# EAGLE design OutputSlice (EAGLE 7.5.0)
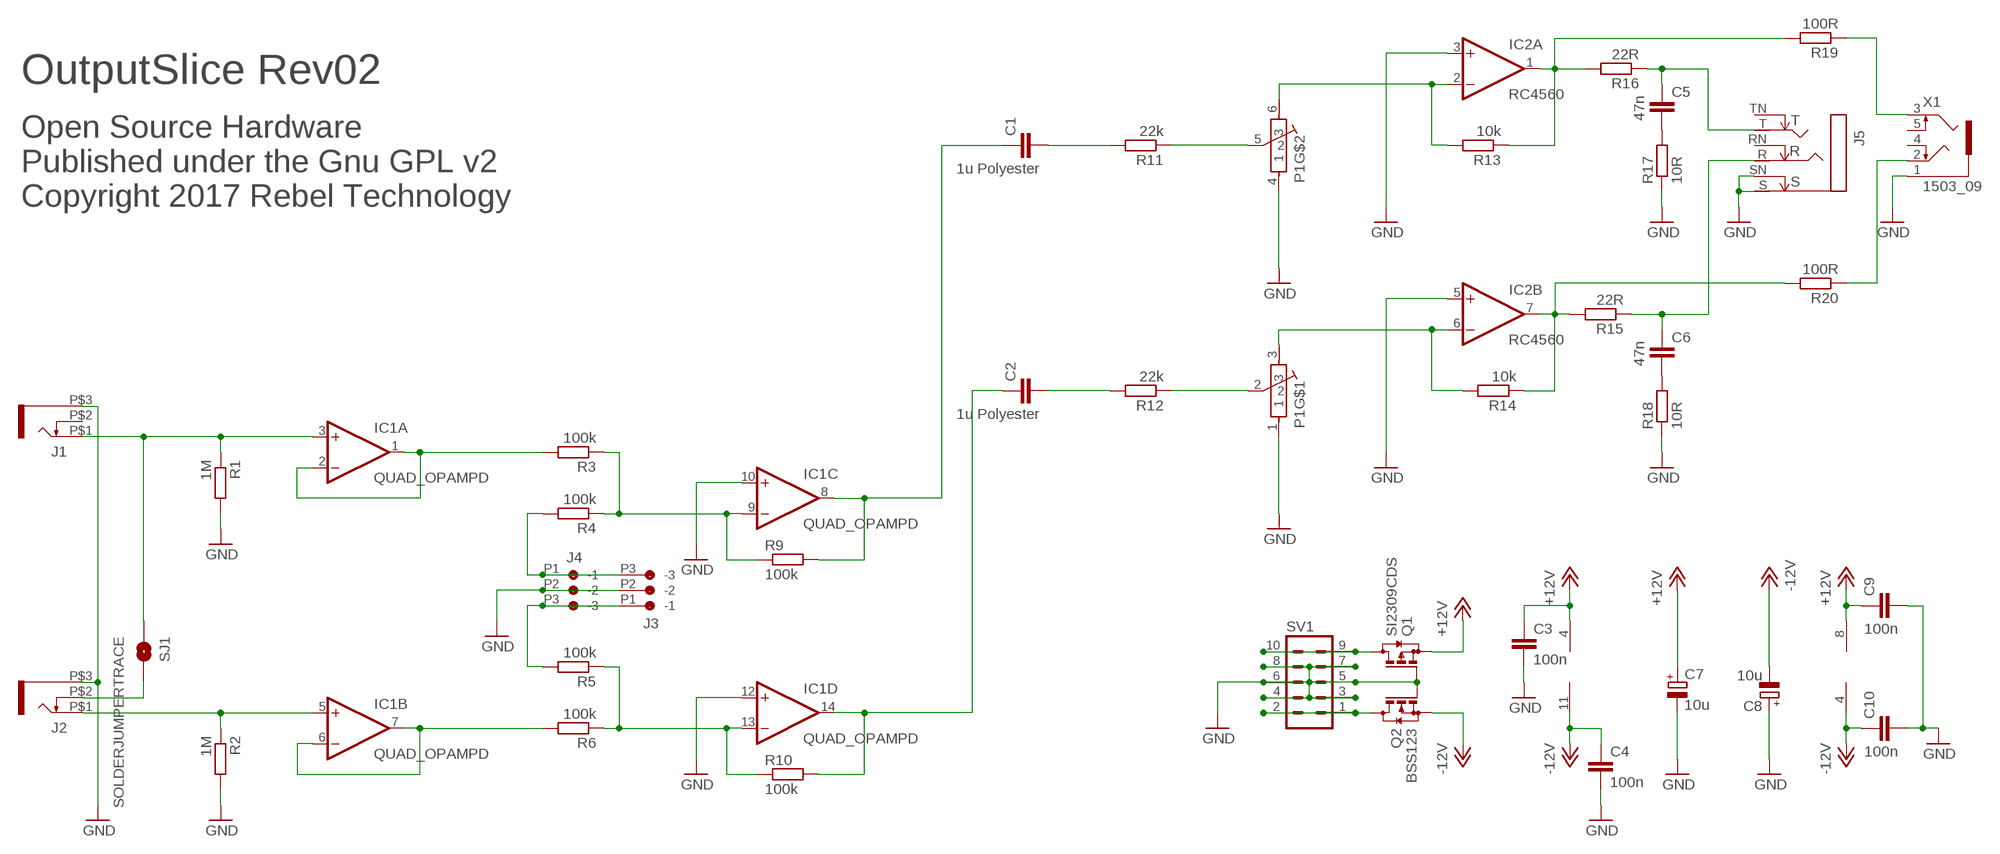
[diagram p0: schematic, sheet 1]

## Parts
C1  1u Polyester  C-EUC1210  [C1210]
C2  1u Polyester  C-EUC1210  [C1210]
C3  100n  C-EUC0603  [C0603]
C4  100n  C-EUC0603  [C0603]
C5  47n  C-EUC0603  [C0603]
C6  47n  C-EUC0603  [C0603]
C7  10u  CPOL-EU153CLV-0505  [153CLV-0505]
C8  10u  CPOL-EU153CLV-0505  [153CLV-0505]
C9  100n  C-EUC0603  [C0603]
C10  100n  C-EUC0603  [C0603]
IC1  QUAD_OPAMPD  [SO14]
IC2  RC4560  NE5532D  [SO08]
J1  JACK-UJ-3502-RSLOT  [UJ-3502-R-SLOT]
J2  JACK-UJ-3502-RSLOT  [UJ-3502-R-SLOT]
J3  CON-JST_PH_3W  [CON-JST_PH_3W]
J4  CON-JST_PH_3W  [CON-JST_PH_3W]
J5  NEUTRIK_NRJ6HFSTD  [NRJ6HF]
P1  POT-BOURNS-PTD902  [POT-BOURNS-PTD902]
Q1  SI2309CDS  BSS84  [SOT23]
Q2  BSS123  [SOT23]
R1  1M  R-EU_0603  [0603]
R2  1M  R-EU_0603  [0603]
R3  100k  R-EU_0603  [0603]
R4  100k  R-EU_0603  [0603]
R5  100k  R-EU_0603  [0603]
R6  100k  R-EU_0603  [0603]
R9  100k  R-EU_0603  [0603]
R10  100k  R-EU_0603  [0603]
R11  22k  R-EU_0603  [0603]
R12  22k  R-EU_0603  [0603]
R13  10k  R-EU_0603  [0603]
R14  10k  R-EU_0603  [0603]
R15  22R  R-EU_0603  [0603]
R16  22R  R-EU_0603  [0603]
R17  10R  R-EU_0603  [0603]
R18  10R  R-EU_0603  [0603]
R19  100R  R-EU_0603  [0603]
R20  100R  R-EU_0603  [0603]
SJ1  SOLDERJUMPERTRACE  [SJ_2S-TRACE]
SV1  MA05-2  [MA05-2]
X1  1503_09  [1503_09]

## Nets
+12V: C3.1 C7.+ C9.1 IC1.4(P:V+) IC2.8(P:V+) Q1.2(S)
-12V: C4.1 C8.- C10.1 IC1.11(P:V-) IC2.4(P:V-) Q2.2(S)
BUS_IN_L: J3.P3(-3) J4.P1(-1) R4.2
BUS_IN_R: J3.P1(-1) J4.P3(-3) R5.2
GND: C3.2 C4.2 C7.- C8.+ C9.2 C10.2 IC1.10(C:+IN) IC1.12(D:+IN) IC2.3(A:+IN) IC2.5(B:+IN) J1.P$3(SLEEVE) J2.P$3(SLEEVE) J3.P2(-2) J4.P2(-2) J5.S J5.SN P1.1 P1.4 Q1.1(G) Q2.1(G) R1.2 R2.2 R17.1 R18.1 SV1.3 SV1.4 SV1.5 SV1.6 SV1.7 SV1.8 X1.1
HP_L: C5.1 J5.T R16.1
HP_R: C6.1 J5.R R15.1
IN_B1: J2.P$2(SW) SJ1.2
IN_L: IC1.3(A:+IN) J1.P$1(TIP) R1.1 SJ1.1
IN_R: IC1.5(B:+IN) J2.P$1(TIP) R2.1
LINE_L: R19.1 X1.3
LINE_R: R20.1 X1.2
N$1: Q2.3(D) SV1.1 SV1.2
N$2: IC2.7(B:OUT) R14.1 R15.2 R20.2
N$3: IC2.2(A:-IN) P1.6 R13.2
N$4: C2.2 R12.2
N$5: P1.5 R11.1
N$6: P1.2 R12.1
N$7: C2.1 IC1.14(D:OUT) R10.2
N$8: C1.2 R11.2
N$10: C1.1 IC1.8(C:OUT) R9.2
N$11: IC1.6(B:-IN) IC1.7(B:OUT) R6.2
N$12: C6.2 R18.2
N$13: IC1.1(A:OUT) IC1.2(A:-IN) R3.2
N$14: Q1.3(D) SV1.9 SV1.10
N$16: IC2.6(B:-IN) P1.3 R14.2
N$19: IC2.1(A:OUT) R13.1 R16.2 R19.2
N$21: C5.2 R17.2
N$45: IC1.13(D:-IN) R5.1 R6.1 R10.1
N$50: IC1.9(C:-IN) R3.1 R4.1 R9.1
Unconnected: J1.P$2(SW) J5.RN J5.TN X1.4 X1.5

## Notes on the sheet
- OutputSlice Rev02
- Open Source Hardware
  Published under the Gnu GPL v2
  Copyright 2017 Rebel Technology

## Library data of the parts
C1-C6 C9 C10 = Rebel:C-EU: CAPACITOR, European symbol
C7 C8 = rcl:CPOL-EU: POLARIZED CAPACITOR, European symbol
IC1 = adafruit:QUAD_OPAMP: OP AMP Standard quad package
IC2 = linear:NE5532: AUDIO AMPLIFIER
J1 J2 = Rebel:JACK-UJ-3502-R
J3 J4 = Rebel:CON-JST_PH_3W
J5 = neutrik_jacks:NEUTRIK_NRJ6HF
P1 = Rebel:POT-BOURNS-PTD902
Q1 = transistor-small-signal:BSS84: P-CHANNEL MOS FET
Q2 = transistor-small-signal:BSS123: N-CHANNEL MOS FET
R1-R6 R9-R20 = Rebel:R-EU_: RESISTOR, European symbol
SJ1 = SparkFun:SOLDERJUMPER: Solder Jumper Standard SMD solder jumper. Used to automate production. Two varients : Normally Open and Normally Closed are the same, but have different paste layers. NC will have a large amount of paste and should jumper during reflow.
SV1 = con-lstb:MA05-2: PIN HEADER; OC_FARNELL: unknown; OC_NEWARK: unknown
X1 = con-lumberg:1503_09: Jack connectors according to JISC 6560, 3.5 mm Klinkeneinbaukupplung nach JISC 6560, 3,5 mm, 3-polig/ stereo, abgewinkelte Ausführung, mit 2 Öffnern und Lötaugen, für Leiterplatten Rückseitenmontage Source: http://www.lumberg.com/Produkte/PDFs/1503_09.pdf; OC_FARNELL: 1243244; OC_NEWARK: unknown

## Board
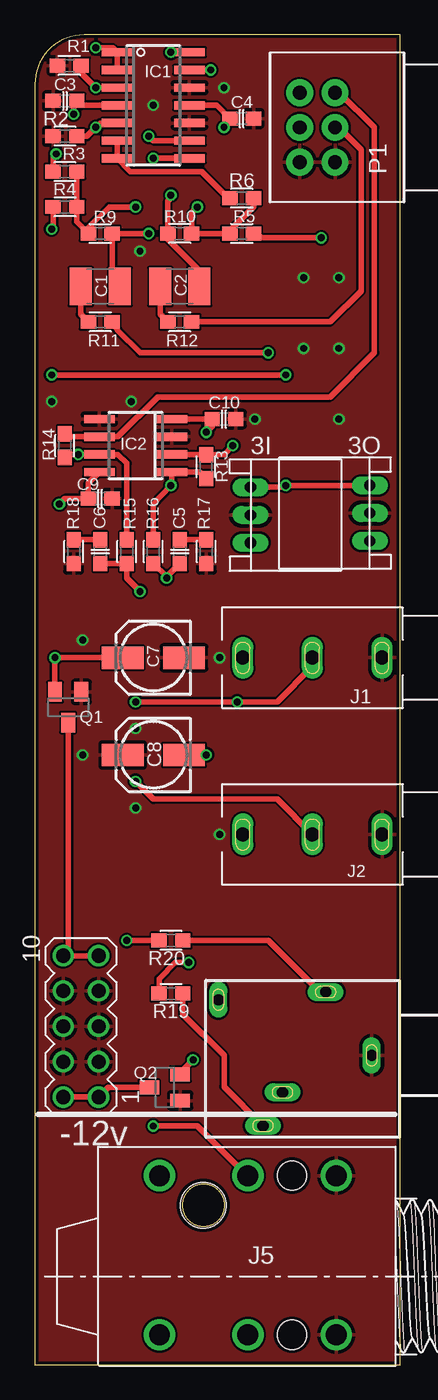
[diagram p1: board, top side]
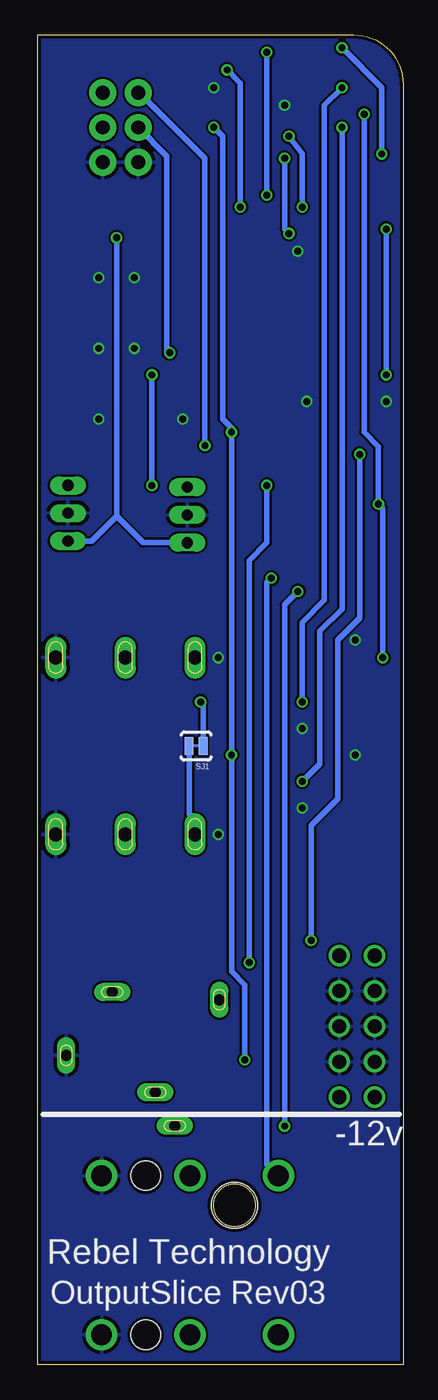
[diagram p2: board, bottom side, seen from below]

Size 26.24 x 95.56 mm. Coordinates in mm from the lower left corner, seen from the top.
Outline: 26.24,0 26.24,95.56 3.56,95.56 arc90 0,92 0,0 26.24,0
Copper layers (1*16): Top 0.035mm / dielectric 1.5mm / Bottom 0.035mm
Design rules "SeeedStudio_2layer_DRU_no_angle_20140221": minimum track width 6mil, minimum drill 12mil, track to track 6mil, track to pad 6mil, pad to pad 6mil, via to via 6mil, smd to smd 0mil, copper to edge 10mil, drill to drill 10mil, minimum pad ring 10mil, minimum via ring 6mil, stop-mask expansion 2mil, vias tented up to drill 100mil, thermal gap 10mil

### Footprints (pad centres in the part's own frame; a part is rotated, then mirrored left to right if it is on the bottom)
C1210 = smd 1.6 x 2.7: 1 -1.4,0; 2 1.4,0
C0603 = smd 1.1 x 1: 1 -0.85,0; 2 0.85,0
153CLV-0505 = smd 3 x 1.6: + 2.2,0; - -2.2,0
SO14 = smd 0.6 x 2.2: 1 -3.81,-2.6; 2 -2.54,-2.6; 3 -1.27,-2.6; 4 0,-2.6; 5 1.27,-2.6; 6 2.54,-2.6; 7 3.81,-2.6; 8 3.81,2.6; 9 2.54,2.6; 10 1.27,2.6; 11 0,2.6; 12 -1.27,2.6; 13 -2.54,2.6; 14 -3.81,2.6
SO08 = smd 0.6 x 2.2: 1 -1.905,-2.6; 2 -0.635,-2.6; 3 0.635,-2.6; 4 1.905,-2.6; 5 1.905,2.6; 6 0.635,2.6; 7 -0.635,2.6; 8 -1.905,2.6
UJ-3502-R-SLOT = drill 1 long: P$1 0,0; P$2 0,5; P$3 0,-5
CON-JST_PH_3W = drill 0.8 long: P1 0,0; P2 -2,0; P3 -4,0
NRJ6HF = drill 1.5: R 0,7.231; RN 0,-4.199; S 6.35,7.231; SN 6.35,-4.199; T -6.35,7.231; TN -6.35,-4.199 | hole 2.1: 3.175,7.231; 3.175,-4.199 | hole 3.3: -3.2,5.1
POT-BOURNS-PTD902 = drill 1 pad 1.93: 1 -2.5,-0.036; 2 0,-0.036; 3 2.5,-0.036; 4 -2.5,2.5; 5 0,2.5; 6 2.5,2.5
SOT23 = smd 1 x 1.4: 1 -0.95,-1.1; 2 0.95,-1.1; 3 0,1.1
0603 = smd 1.1 x 1: 1 -0.85,0; 2 0.85,0
SJ_2S-TRACE = smd 0.635 x 1.27: 1 -0.508,0; 2 0.508,0
MA05-2 = drill 1.016: 1 -5.08,-1.27; 2 -5.08,1.27; 3 -2.54,-1.27; 4 -2.54,1.27; 5 0,-1.27; 6 0,1.27; 7 2.54,-1.27; 8 2.54,1.27; 9 5.08,-1.27; 10 5.08,1.27
1503_09 = drill 0.8 pad 1.2 long: 1 0,-2.1; 2 -4.55,-5.4; 3 5.05,-9.9; 4 -4,-13.1; 5 2.65,-8.5

### Placement (x,y rotation side)
C1  4.7,77.47 180 top
C2  10.41,77.47 180 top
C3  2.16,90.81 180 top
C4  14.86,89.53 0 top
C5  10.41,58.42 90 top
C6  4.7,58.42 90 top
C7  8.51,50.8 180 top
C8  8.51,43.81 180 top
C9  4.7,62.23 0 top
C10  13.59,67.94 0 top
IC1  8.51,90.49 270 top
IC2  7.24,66.04 90 top
J1  19.94,50.8 90 top
J2  19.94,38.1 90 top
J3  15.49,59.05 270 top
J4  24.07,63.18 90 top
J5  15.3,6.35 0 top
P1  21.53,88.9 90 top
Q1  2.4,47.24 180 top
Q2  9.33,19.93 90 top
R1  2.48,93.34 180 top
R2  2.16,88.26 180 top
R3  2.16,85.72 180 top
R4  2.16,83.19 180 top
R5  14.86,81.28 0 top
R6  14.86,83.82 180 top
R9  4.7,81.28 0 top
R10  10.41,81.28 180 top
R11  4.7,74.93 180 top
R12  10.41,74.93 180 top
R13  12.3,64.52 90 top
R14  2.16,66.04 90 top
R15  6.6,58.42 90 top
R16  8.51,58.42 90 top
R17  12.32,58.42 90 top
R18  2.79,58.42 90 top
R19  9.78,26.67 180 top
R20  9.78,30.48 180 top
SJ1  14.86,44.45 180 bottom
SV1  3.31,24.31 90 top
X1  26.29,22.23 270 top

### Tracks (layer width: path | path; a pad name or v marks a point on that pad's centre or on a via)
+12V  (via drill 0.5)
  Top 0.406: Q1.2 v1.45,50.8 C7.+ | IC2.8 3.85,63.35 C9.1 2.16,62.23 v1.77,61.84 | IC1.4 3.33,90.49 C3.1 2.79,90.59 v2.79,89.85
  Bottom 0.406: v2.79,89.85 2.79,66.99 1.77,65.97 v1.77,61.84 1.45,61.52 v1.45,50.8
-12V  (via drill 0.5)
  Top 0.406: IC2.4 C10.1 12.74,67.41 v12.32,66.99 | Q2.2 10.43,20.98 v11.37,21.91 | IC1.11 13.06,90.49 C4.1 14.01,89.32 v13.59,88.9 | C8.- v12.32,43.81
  Bottom 0.406: v11.37,21.91 11.37,27.3 12.32,28.26 v12.32,43.81 v12.32,66.99 12.32,67.31 12.95,67.94 12.95,88.26 v13.59,88.9
BUS_IN_L  (via drill 0.5)
  Top 0.406: R4.2 1.31,81.7 v1.21,81.6 | v1.21,71.12 v18.03,71.12 | J3.P3 17.91,63.05 v18.03,63.18 J4.P1
  Bottom 0.406: v1.21,71.12 v1.21,81.6 | v18.03,71.12 v18.03,63.18
BUS_IN_R  (via drill 0.5)
  Top 0.406: v20.57,80.96 16.34,80.96 R5.2
  Bottom 0.406: v20.57,80.96 20.57,60.96 | 20.57,60.96 22.35,59.18 J4.P3 | J3.P1 18.67,59.05 20.57,60.96
GND  (via drill 0.5)
  other vias: 7.24,40.01 13.27,50.8 7.56,80.01 19.3,73.03 3.43,52.07 19.3,78.1 1.21,69.22 7.24,45.72 3.43,43.81 13.27,38.1 6.92,69.22 8.51,90.49 21.84,73.03 21.84,67.94 21.84,78.1 13.59,91.76 15.81,67.94
  pour Bottom: -10.54,-3.81 33.91,-3.81 33.91,96.52 -10.54,96.52
  pour Top: -9.27,-3.81 35.18,-3.81 35.18,96.52 -9.27,96.52
HP_L  (via drill 0.5)
  Top 0.406: v9.46,56.52 9.46,56.62 | 9.46,56.62 R16.1 | 9.46,56.62 C5.1
  Bottom 0.406: v9.46,56.52 9.78,56.2 9.78,14.41 J5.T
HP_R  (via drill 0.5)
  Top 0.406: C6.1 R15.1 6.6,56.52 v7.56,55.56 | v8.51,17.14 11.68,17.14 15.25,13.58 J5.R
  Bottom 0.406: v7.56,55.56 8.51,54.61 v8.51,17.14
IN_B1
  Bottom 0.406: SJ1.2 15.37,39.56 14.94,39.13 J2.P$2
IN_L  (via drill 0.5)
  Top 0.406: R1.1 3.01,93.13 v4.38,91.76 IC1.3 | v7.24,47.62 v14.54,47.62 17.4,47.62 19.94,50.16 J1.P$1
  Bottom 0.406: v7.24,47.62 7.24,53.34 5.65,54.93 5.65,90.49 v4.38,91.76 | SJ1.1 14.35,47.44 v14.54,47.62
IN_R  (via drill 0.5)
  Top 0.406: R2.1 3.75,88.26 v4.38,88.9 4.7,89.22 IC1.5 | v7.24,41.91 8.51,40.64 17.4,40.64 J2.P$1
  Bottom 0.406: v7.24,41.91 5.97,43.18 5.97,52.7 4.38,54.29 v4.38,88.9
LINE_L
  Top 0.406: R19.1 10.63,25.18 13.59,22.23 13.59,19.98 X1.3
LINE_R
  Top 0.406: R20.1 16.76,30.48 20.47,26.77 X1.2
N$1
  Top 0.406: SV1.2 SV1.1 5.28,19.93 Q2.3
N$2  (via drill 0.5)
  Top 0.406: R14.1 2.37,65.41 v3.11,65.41 IC2.7 5.97,65.41 6.6,64.77 R15.2 | v6.6,30.48 R20.2
  Bottom 0.406: v3.11,65.41 3.11,53.66 4.7,52.07 4.7,40.64 6.6,38.73 v6.6,30.48
N$3  (via drill 0.5)
  Top 0.406: IC2.2 12.26,65.41 R13.2 12.97,65.41 13.59,65.41 v14.22,66.04
  Bottom 0.406: v14.22,66.04 14.22,86.68 18.99,91.44 P1.6
N$4
  Top 0.406: C2.2 9.01,75.48 R12.2
N$5  (via drill 0.5)
  Top 0.406: v16.76,72.71 7.56,72.71 5.97,74.29 R11.1
  Bottom 0.406: v16.76,72.71 16.95,72.83 16.95,86.83 P1.5
N$6
  Top 0.406: R12.1 21.21,74.93 23.43,77.15 23.43,87.31 21.84,88.9 P1.2
N$7  (via drill 0.5)
  Top 0.406: v9.78,94.3 IC1.14 | C2.1 11.81,78.61 9.56,80.86 R10.2 9.56,83.6 9.78,83.82 v9.78,84.03
  Bottom 0.406: v9.78,94.3 v9.78,84.03
N$8
  Top 0.406: C1.2 3.3,75.48 R11.2
N$10  (via drill 0.5)
  Top 0.406: IC1.8 v8.51,86.68 | v8.19,81.28 R9.2 5.55,78.02 C1.1
  Bottom 0.406: v8.51,86.68 8.51,81.6 v8.19,81.28
N$11
  Top 0.406: IC1.6 IC1.7 6.86,85.72 12,85.72 13.91,83.82 R6.2
N$12
  Top 0.406: C6.2 R18.2
N$13  (via drill 0.5)
  Top 0.406: IC1.2 IC1.1 5.59,94.62 v4.38,94.62 | R3.2 1.31,86.78 v1.52,87
  Bottom 0.406: v1.52,87 1.52,91.76 v4.38,94.62
N$14
  Top 0.406: Q1.3 2.4,29.75 SV1.10 SV1.9
N$16
  Top 0.406: R14.2 2.06,66.68 IC2.6 5.97,66.68 8.83,69.53 21.21,69.53 24.38,72.71 24.38,88.9 21.88,91.4 P1.3
N$19  (via drill 0.5)
  Top 0.406: R13.1 11.83,64.13 IC2.1 9.84,63.24 v9.78,63.18 9.72,63.12 8.51,61.85 R16.2 | v11.05,28.89 10.1,28.89 8.93,27.73 R19.2
  Bottom 0.406: v9.78,63.18 9.78,59.05 11.05,57.78 v11.05,28.89
N$21
  Top 0.406: R17.2 C5.2
N$45  (via drill 0.5)
  Top 0.406: R6.1 15.71,83.19 14.01,81.5 R5.1 R10.1 11.26,82.76 v11.68,83.19 | v12.64,93.03 IC1.13
  Bottom 0.406: v11.68,83.19 11.68,92.07 v12.64,93.03
N$50  (via drill 0.5)
  Top 0.406: R3.1 R4.1 3.01,82.12 R9.1 3.85,81.7 5.33,83.19 v7.24,83.19 | v8.19,88.26 8.51,87.95 IC1.9
  Bottom 0.406: v7.24,83.19 7.24,87 v8.19,88.26

### Text on the board
tPlace: 3I | 3O | -12v
bPlace: -12v | Rebel Technology | OutputSlice Rev03